# Altium schematic sheet Superbot_hbridge_mk3.SchDoc
size A4
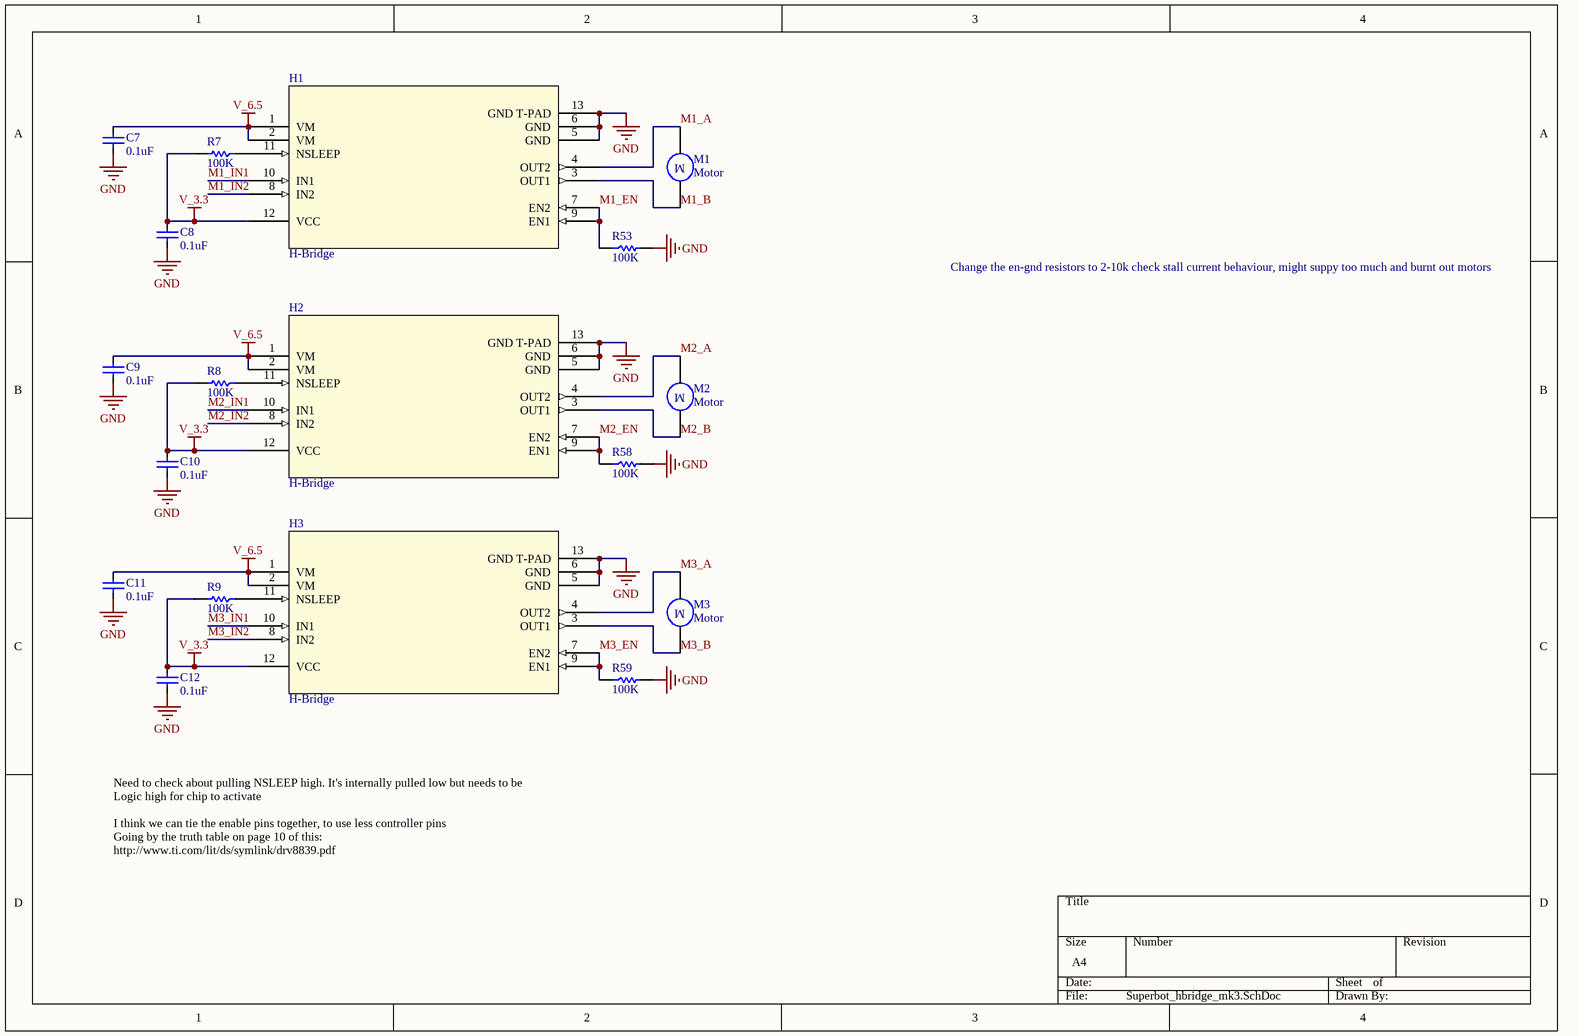
[diagram p0: Superbot_hbridge_mk3.SchDoc]

## Parts
C7  0.1uF  [CAP0603R]
C8  0.1uF  [CAP0603R]
C9  0.1uF  [CAP0603R]
C10  0.1uF  [CAP0603R]
C11  0.1uF  [CAP0603R]
C12  0.1uF  [CAP0603R]
H1  H-Bridge  [WSON_0.8mm_DSS0012A]
H2  H-Bridge  [WSON_0.8mm_DSS0012A]
H3  H-Bridge  [WSON_0.8mm_DSS0012A]
M1  Motor  [MicroMotor_TypeA]
M2  Motor  [MicroMotor_TypeA]
M3  Motor  [MicroMotor_TypeA]
R7  100K  [RES0603R]
R8  100K  [RES0603R]
R9  100K  [RES0603R]
R53  100K  [RES0603R]
R58  100K  [RES0603R]
R59  100K  [RES0603R]

## Nets
GND: C7.2 C8.2 C9.2 C10.2 C11.2 C12.2 H1.5(GND) H1.6(GND) H1.13(GND_T-PAD) H2.5(GND) H2.6(GND) H2.13(GND_T-PAD) H3.5(GND) H3.6(GND) H3.13(GND_T-PAD) R53.2 R58.2 R59.2
V_3.3: C8.1 C10.1 C12.1 H1.12(VCC) H2.12(VCC) H3.12(VCC) R7.2 R8.2 R9.2
V_6.5: C7.1 C9.1 C11.1 H1.1(VM) H1.2(VM) H2.1(VM) H2.2(VM) H3.1(VM) H3.2(VM)
M1_A: H1.4(OUT2) M1.2
M1_B: H1.3(OUT1) M1.1
M1_EN: H1.7(EN2) H1.9(EN1) R53.1
M1_IN1: H1.10(IN1)
M1_IN2: H1.8(IN2)
M2_A: H2.4(OUT2) M2.2
M2_B: H2.3(OUT1) M2.1
M2_EN: H2.7(EN2) H2.9(EN1) R58.1
M2_IN1: H2.10(IN1)
M2_IN2: H2.8(IN2)
M3_A: H3.4(OUT2) M3.2
M3_B: H3.3(OUT1) M3.1
M3_EN: H3.7(EN2) H3.9(EN1) R59.1
M3_IN1: H3.10(IN1)
M3_IN2: H3.8(IN2)
NetH1_11: H1.11(NSLEEP) R7.1
NetH2_11: H2.11(NSLEEP) R8.1
NetH3_11: H3.11(NSLEEP) R9.1

## Notes on the sheet
- Change the en-gnd resistors to 2-10k check stall current behaviour, might suppy too much and burnt out motors
- Need to check about pulling NSLEEP high. It's internally pulled low but needs to be Logic high for chip to activate
  I think we can tie the enable pins together, to use less controller pins
  Going by the truth table on page 10 of this: http://www.ti.com/lit/ds/symlink/drv8839.pdf
- (in symbol Motor) M

## Library data of the parts
C7-C12 = C: Capacitor; Manufacturer: Microchip Technology; Manufacturer Part Num: MIC5378YC5-TR; Class I: Passive; Revision: July-2002: Re-released for DXP Platform.; Supplier 1: Digikey; Supplier Part Number 1: *; Supplier Part Number 1: 1611-MIC5378YC5-CT-ND; Value: 0.1uF
H1-H3 = DRV8839DSSR: 1.8A , Half Bridge (2), Driver - Fully Integrated, Control and Power Stage; Manufacturer: Texas Instruments; Class I: PIM; Value: Value; Manufacturer Part Num: DRV8839DSSR; Supplier 1: Digikey; Supplier Part Number 1: 296-35701-1-ND
R7-R9 R53 R58 R59 = R: Resistor; Supplier 1: Digikey; Supplier Part Number 1: *; Value: 100K